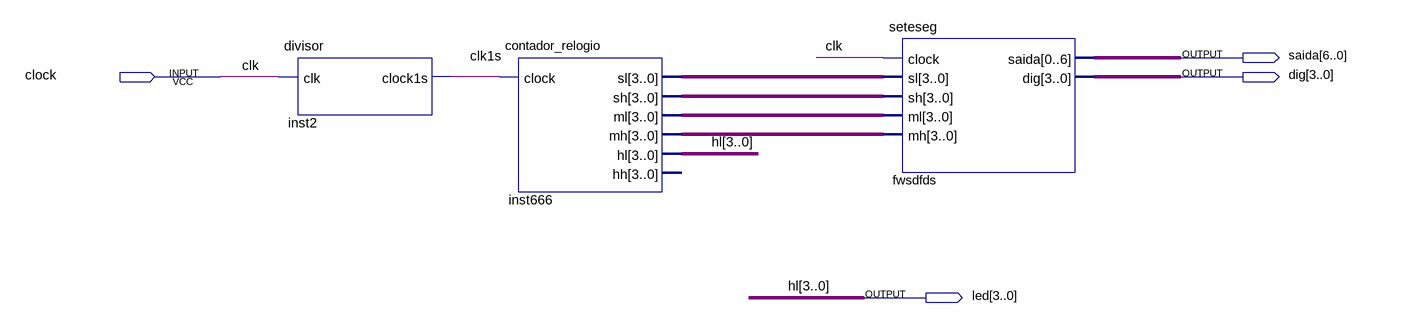
[diagram p0: schematic sheet]
// Quartus schematic testecont7seg.bdf as structural Verilog: 3 symbols, 4 pins
module testecont7seg (
  input  clock,
  output [6:0] saida,
  output [3:0] dig,
  output [3:0] led
);

  wire clk1s;
  wire [3:0] inst666_mh, inst666_ml, inst666_sh, inst666_sl;

  divisor inst2 (.clk(clock), .clock1s(clk1s));
  contador_relogio inst666 (
    .clock(clk1s), .sl(inst666_sl), .sh(inst666_sh), .ml(inst666_ml), .mh(inst666_mh), .hl(led));  // open: hh
  seteseg fwsdfds (
    .clock(clock), .sl(inst666_sl), .sh(inst666_sh), .ml(inst666_ml), .mh(inst666_mh), .saida(saida),
    .dig(dig));

  // Other names for the same wires on the sheet: clk = clock; hl[3:0] = led
endmodule
